# EAGLE design main (EAGLE 6.6.0)
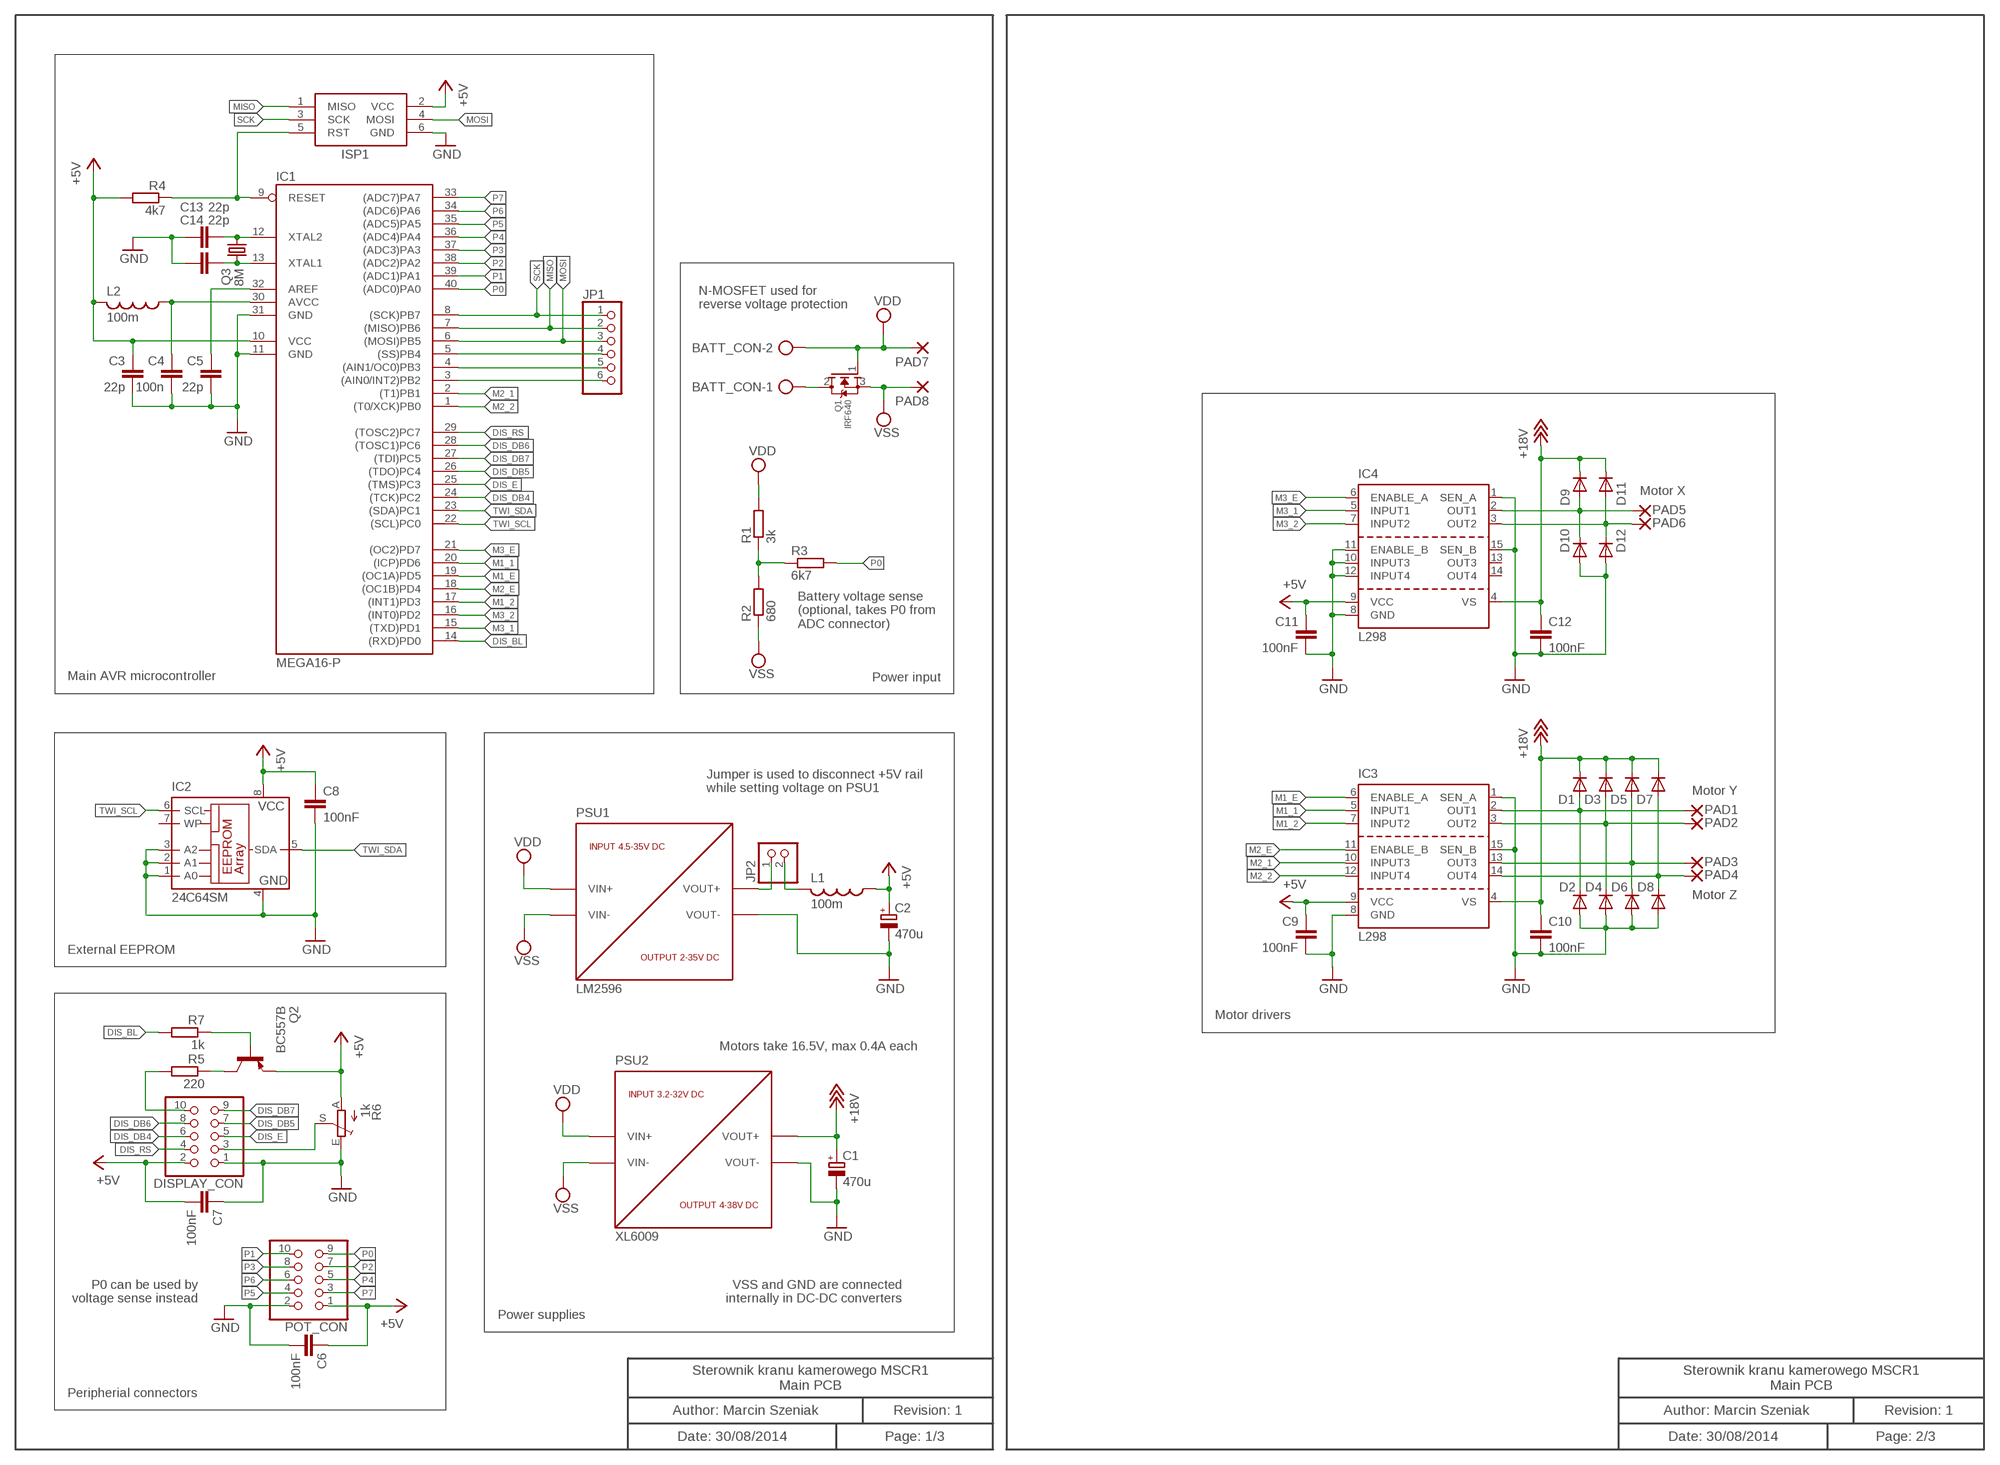
[diagram p0: schematic, sheet 1]

## Parts
BATT_CON  AK500/2-H  [AK500/2-H]
C1  470u  CPOL-EUE3.5-8  [E3,5-8]
C2  470u  CPOL-EUE5-8.5  [E5-8,5]
C3  22p  C-EU025-025X050  [C025-025X050]
C4  100n  C-EU025-025X050  [C025-025X050]
C5  22p  C-EU025-025X050  [C025-025X050]
C6  100nF  C-EU025-025X050  [C025-025X050]
C7  100nF  C-EU050-024X044  [C050-024X044]
C8  100nF  C-EU050-024X044  [C050-024X044]
C9  100nF  C-EU075-032X103  [C075-032X103]
C10  100nF  C-EU075-032X103  [C075-032X103]
C11  100nF  C-EU075-032X103  [C075-032X103]
C12  100nF  C-EU075-032X103  [C075-032X103]
C13  22p  C-EU025-025X050  [C025-025X050]
C14  22p  C-EU025-025X050  [C025-025X050]
D1  UF4003  [DO41-10]
D2  UF4003  [DO41-10]
D3  UF4003  [DO41-10]
D4  UF4003  [DO41-10]
D5  UF4003  [DO41-10]
D6  UF4003  [DO41-10]
D7  UF4003  [DO41-10]
D8  UF4003  [DO41-10]
D9  UF4003  [DO41-10]
D10  UF4003  [DO41-10]
D11  UF4003  [DO41-10]
D12  UF4003  [DO41-10]
DISPLAY_CON  PINHD-2X5  [2X05]
IC1  MEGA16-P  [DIL40]
IC2  24C64SM  [SO-08M]
IC3  L298  [MULTIWATT-15]
IC4  L298  [MULTIWATT-15]
ISP1  AVRISP-6  [AVRISP]
JP1  PINHD-1X6  [1X06]
JP2  PINHD-1X2  [1X02]
L1  100m  L-US0204/7  [0204/7]
L2  100m  L-US0204/7  [0204/7]
PAD1  2,54/1,1KLOCWIRE1  [KLOCWIRE1]
PAD2  2,54/1,1KLOCWIRE1  [KLOCWIRE1]
PAD3  2,54/1,1KLOCWIRE1  [KLOCWIRE1]
PAD4  2,54/1,1KLOCWIRE1  [KLOCWIRE1]
PAD5  2,54/1,1KLOCWIRE1  [KLOCWIRE1]
PAD6  2,54/1,1KLOCWIRE1  [KLOCWIRE1]
PAD7  2,54/1,1KLOCWIRE1  [KLOCWIRE1]
PAD8  2,54/1,1KLOCWIRE1  [KLOCWIRE1]
POT_CON  PINHD-2X5  [2X05]
PSU1  LM2596  DC-DC_CONV_DN  [DC-DC_CONV_MODULE]
PSU2  XL6009  DC-DC_CONV_UP  [DC-DC_CONV_MODULE]
Q1  IRF640  MOSFET-NGDS_TO220V  [TO220V]
Q2  BC557B  [TO92-EBC]
Q3  8M  CRYSTALTC26V  [TC26V]
R1  3k  R-EU_0204/7  [0204/7]
R2  680  R-EU_0204/7  [0204/7]
R3  6k7  R-EU_0204/5  [0204/5]
R4  4k7  R-EU_0204/5  [0204/5]
R5  220  R-EU_0204/7  [0204/7]
R6  1k  TRIM_EU-CA6V  [CA6V]
R7  1k  R-EU_0204/7  [0204/7]

## Nets
+5V: C2.+ C3.1 C6.1 C7.2 C8.1 C9.1 C11.1 DISPLAY_CON.2 IC1.10(VCC) IC2.8(VCC) IC3.9(VCC) IC4.9(VCC) ISP1.2(VCC) L1.1 L2.2 POT_CON.1 Q2.E R4.2 R6.A
+18V: C1.+ C10.1 C12.1 D1.C D3.C D5.C D7.C D9.C D11.C IC3.4(VS) IC4.4(VS) PSU2.OUT+(VOUT+)
DIS_BL: IC1.14((RXD)PD0) R7.2
DIS_DB4: DISPLAY_CON.6 IC1.24((TCK)PC2)
DIS_DB5: DISPLAY_CON.7 IC1.26((TDO)PC4)
DIS_DB6: DISPLAY_CON.8 IC1.28((TOSC1)PC6)
DIS_DB7: DISPLAY_CON.9 IC1.27((TDI)PC5)
DIS_E: DISPLAY_CON.5 IC1.25((TMS)PC3)
DIS_RS: DISPLAY_CON.4 IC1.29((TOSC2)PC7)
DIS_VO: DISPLAY_CON.3 R6.S
GND: C1.- C2.- C3.2 C4.2 C5.2 C6.2 C7.1 C8.2 C9.2 C10.2 C11.2 C12.2 C13.2 C14.2 D2.A D4.A D6.A D8.A D10.A D12.A DISPLAY_CON.1 IC1.11(GND) IC1.31(GND) IC2.1(A0) IC2.2(A1) IC2.3(A2) IC2.4(GND) IC3.1(SEN_A) IC3.8(GND) IC3.15(SEN_B) IC4.1(SEN_A) IC4.8(GND) IC4.10(INPUT3) IC4.11(ENABLE_B) IC4.12(INPUT4) IC4.15(SEN_B) ISP1.6(GND) POT_CON.2 PSU1.OUT-(VOUT-) PSU2.OUT-(VOUT-) R6.E
M1_1: IC1.20((ICP)PD6) IC3.5(INPUT1)
M1_2: IC1.17((INT1)PD3) IC3.7(INPUT2)
M1_E: IC1.19((OC1A)PD5) IC3.6(ENABLE_A)
M2_1: IC1.2((T1)PB1) IC3.10(INPUT3)
M2_2: IC1.1((T0/XCK)PB0) IC3.12(INPUT4)
M2_E: IC1.18((OC1B)PD4) IC3.11(ENABLE_B)
M3_1: IC1.15((TXD)PD1) IC4.5(INPUT1)
M3_2: IC1.16((INT0)PD2) IC4.7(INPUT2)
M3_E: IC1.21((OC2)PD7) IC4.6(ENABLE_A)
MISO: IC1.7((MISO)PB6) ISP1.1(MISO) JP1.2
MOSI: IC1.6((MOSI)PB5) ISP1.4(MOSI) JP1.3
N$1: JP2.1 PSU1.OUT+(VOUT+)
N$2: DISPLAY_CON.10 R5.2
N$3: IC1.5((SS)PB4) JP1.4
N$4: IC1.4((AIN1/OC0)PB3) JP1.5
N$5: IC1.3((AIN0/INT2)PB2) JP1.6
N$6: BATT_CON.1 Q1.2(D)
N$8: D1.A D2.C IC3.2(OUT1) PAD1.1(P)
N$9: D3.A D4.C IC3.3(OUT2) PAD2.1(P)
N$10: D5.A D6.C IC3.13(OUT3) PAD3.1(P)
N$11: D9.A D10.C IC4.2(OUT1) PAD5.1(P)
N$12: D7.A D8.C IC3.14(OUT4) PAD4.1(P)
N$13: D11.A D12.C IC4.3(OUT2) PAD6.1(P)
N$14: C13.1 IC1.12(XTAL2) Q3.2
N$15: Q2.C R5.1
N$16: C14.1 IC1.13(XTAL1) Q3.1
N$19: JP2.2 L1.2
N$20: Q2.B R7.1
N$25: C4.1 IC1.30(AVCC) L2.1
N$26: C5.1 IC1.32(AREF)
N$28: R1.1 R2.2 R3.1
N$30: IC1.9(RESET) ISP1.5(RST) R4.1
P0: IC1.40((ADC0)PA0) POT_CON.9 R3.2
P1: IC1.39((ADC1)PA1) POT_CON.10
P2: IC1.38((ADC2)PA2) POT_CON.7
P3: IC1.37((ADC3)PA3) POT_CON.8
P4: IC1.36((ADC4)PA4) POT_CON.5
P5: IC1.35((ADC5)PA5) POT_CON.4
P6: IC1.34((ADC6)PA6) POT_CON.6
P7: IC1.33((ADC7)PA7) POT_CON.3
SCK: IC1.8((SCK)PB7) ISP1.3(SCK) JP1.1
TWI_SCL: IC1.22((SCL)PC0) IC2.6(SCL)
TWI_SDA: IC1.23((SDA)PC1) IC2.5(SDA)
VDD: BATT_CON.2 PAD7.1(P) PSU1.IN+(VIN+) PSU2.IN+(VIN+) Q1.1(G) R1.2
VSS: PAD8.1(P) PSU1.IN-(VIN-) PSU2.IN-(VIN-) Q1.3(S) R2.1
Unconnected: IC2.7(WP) IC4.13(OUT3) IC4.14(OUT4)

## Notes on the sheet
- N-MOSFET used for
  reverse voltage protection
- Motor X
- Battery voltage sense
  (optional, takes P0 from
  ADC connector)
- Power input
- Main AVR microcontroller
- Jumper is used to disconnect +5V rail
  while setting voltage on PSU1
- Motor Y
- Motor Z
- External EEPROM
- Motor drivers
- Motors take 16.5V, max 0.4A each
- P0 can be used by
  voltage sense instead
- VSS and GND are connected
  internally in DC-DC converters
- Power supplies
- Sterownik kranu kamerowego MSCR1
  Main PCB
- Sterownik kranu kamerowego MSCR1
  Main PCB
- Peripherial connectors
- Author: Marcin Szeniak | Revision: 1 | Author: Marcin Szeniak | Revision: 1
- Date: 30/08/2014 | Page: 1/3 | Date: 30/08/2014 | Page: 2/3

## Library data of the parts
BATT_CON = con-ptr500:AK500/2-H: CONNECTOR Aug. 2004 / PTR Meßtechnik: Die Bezeichnung der Serie AK505 wurde geändert. Es handelt sich hierbei um AK500 in horizontaler Ausführung.; OC_FARNELL: unknown; OC_NEWARK: unknown
C1 C2 = rcl:CPOL-EU: POLARIZED CAPACITOR, European symbol
C3-C14 = rcl:C-EU: CAPACITOR, European symbol
D1-D12 = diode:UF4003: DIODE ultrafast recovery diode, 200 V rectifier
DISPLAY_CON POT_CON = pinhead:PINHD-2X5: PIN HEADER
IC1 = atmel:MEGA16-P: MICROCONTROLLER 16 Kbytes FLASH 1 kbytes SRAM 512 bytes EEPROM USART 8-channel 10 bit ADC Source: avr.lbr; MPN: ATMEGA16-16PU; OC_FARNELL: 9171142; OC_NEWARK: 01M6885
IC2 = microchip:24*: Serial EEPROM I2C; MF: RAMTRON INTERNATIONAL CORP; MPN: FM24C64-S; OC_FARNELL: 9882685; OC_NEWARK: 98H0189
IC3 IC4 = st-microelectronics:L298: DUAL FULL-BRIDGE DRIVER; MPN: L298N; OC_FARNELL: 1589425; OC_NEWARK: 32M1527
ISP1 = adafruit:AVRISP: AVR ISP HEADER Standard 6 pin header for AVR programming
JP1 = pinhead:PINHD-1X6: PIN HEADER
JP2 = pinhead:PINHD-1X2: PIN HEADER
L1 L2 = resistor:L-US: INDUCTOR, American symbol
PAD1-PAD8 = wirepad:2,54/1,1: THROUGH-HOLE PAD
PSU1 = temp_control:DC-DC_CONV_DN
PSU2 = temp_control:DC-DC_CONV_UP
Q1 = adafruit:MOSFET-N: N-Channel Mosfet 2N7002E - 60V 260mA SOT23 [Digikey: 2N7002ET1GOSTR-ND] - REEL BSH103 - 30V 850mA SOT23 [Digikey: 568-5013-1-ND]
Q2 = transistor-pnp:BC557*: PNP Transistror
Q3 = crystal:CRYSTAL: CRYSTAL; OC_FARNELL: unknown; OC_NEWARK: unknown
R1-R5 R7 = resistor:R-EU_: RESISTOR, European symbol
R6 = pot:TRIM_EU-: POTENTIOMETER

## Board
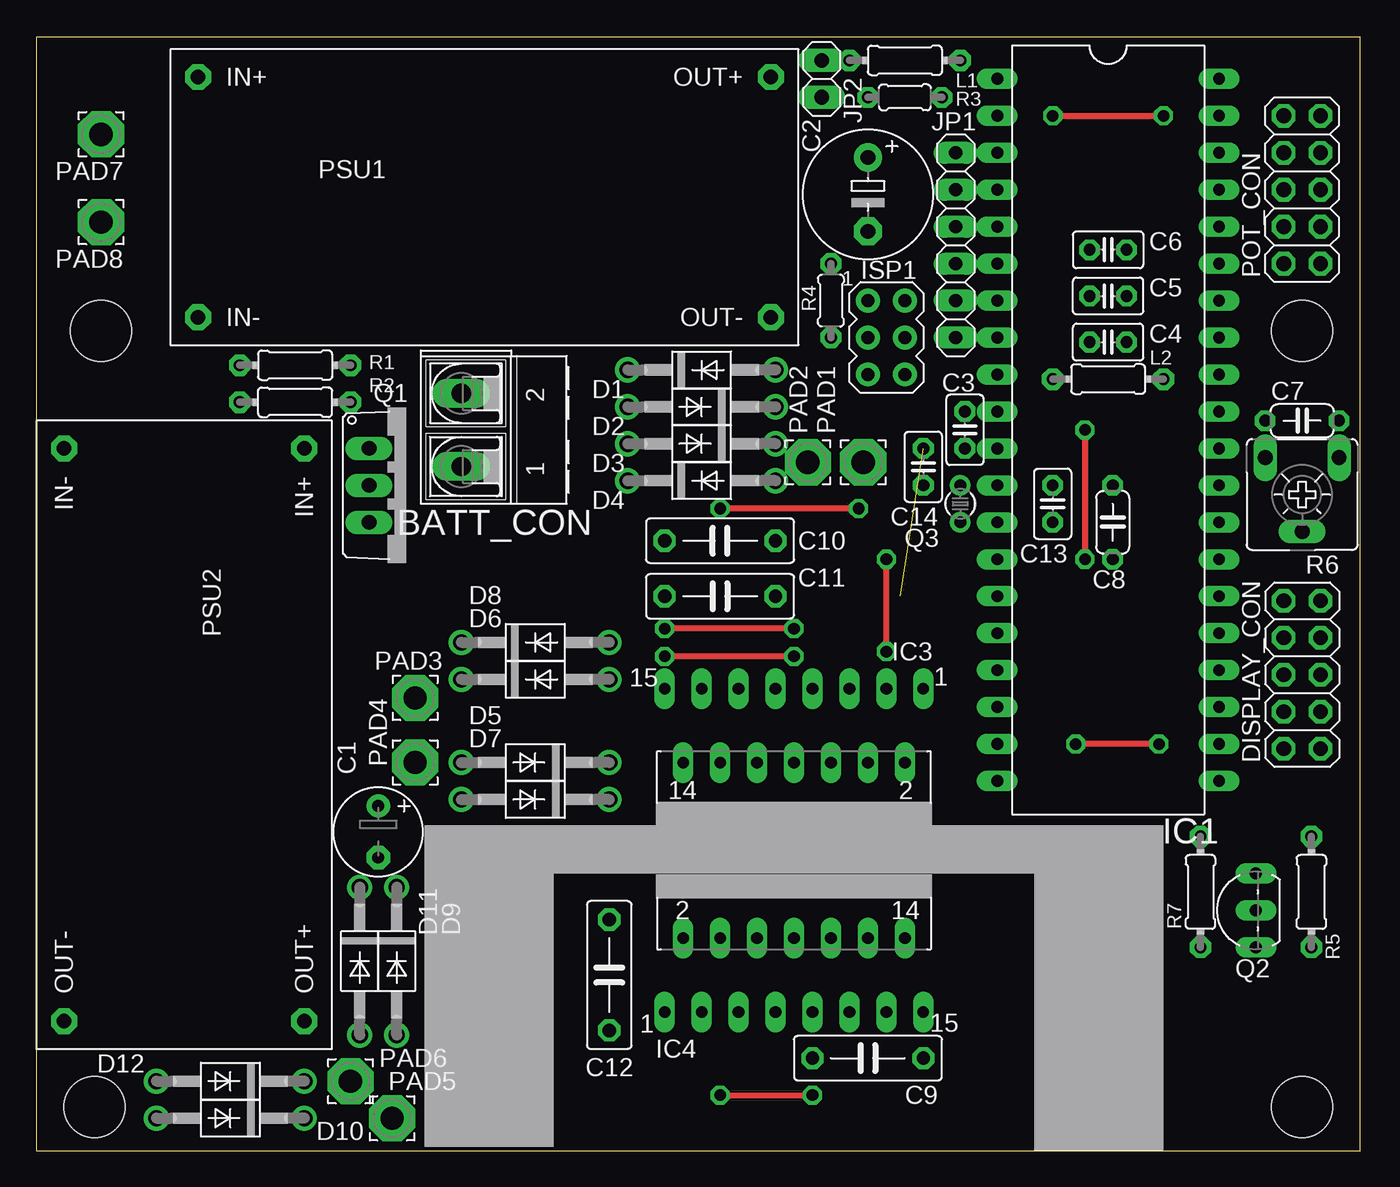
[diagram p1: board, top side]
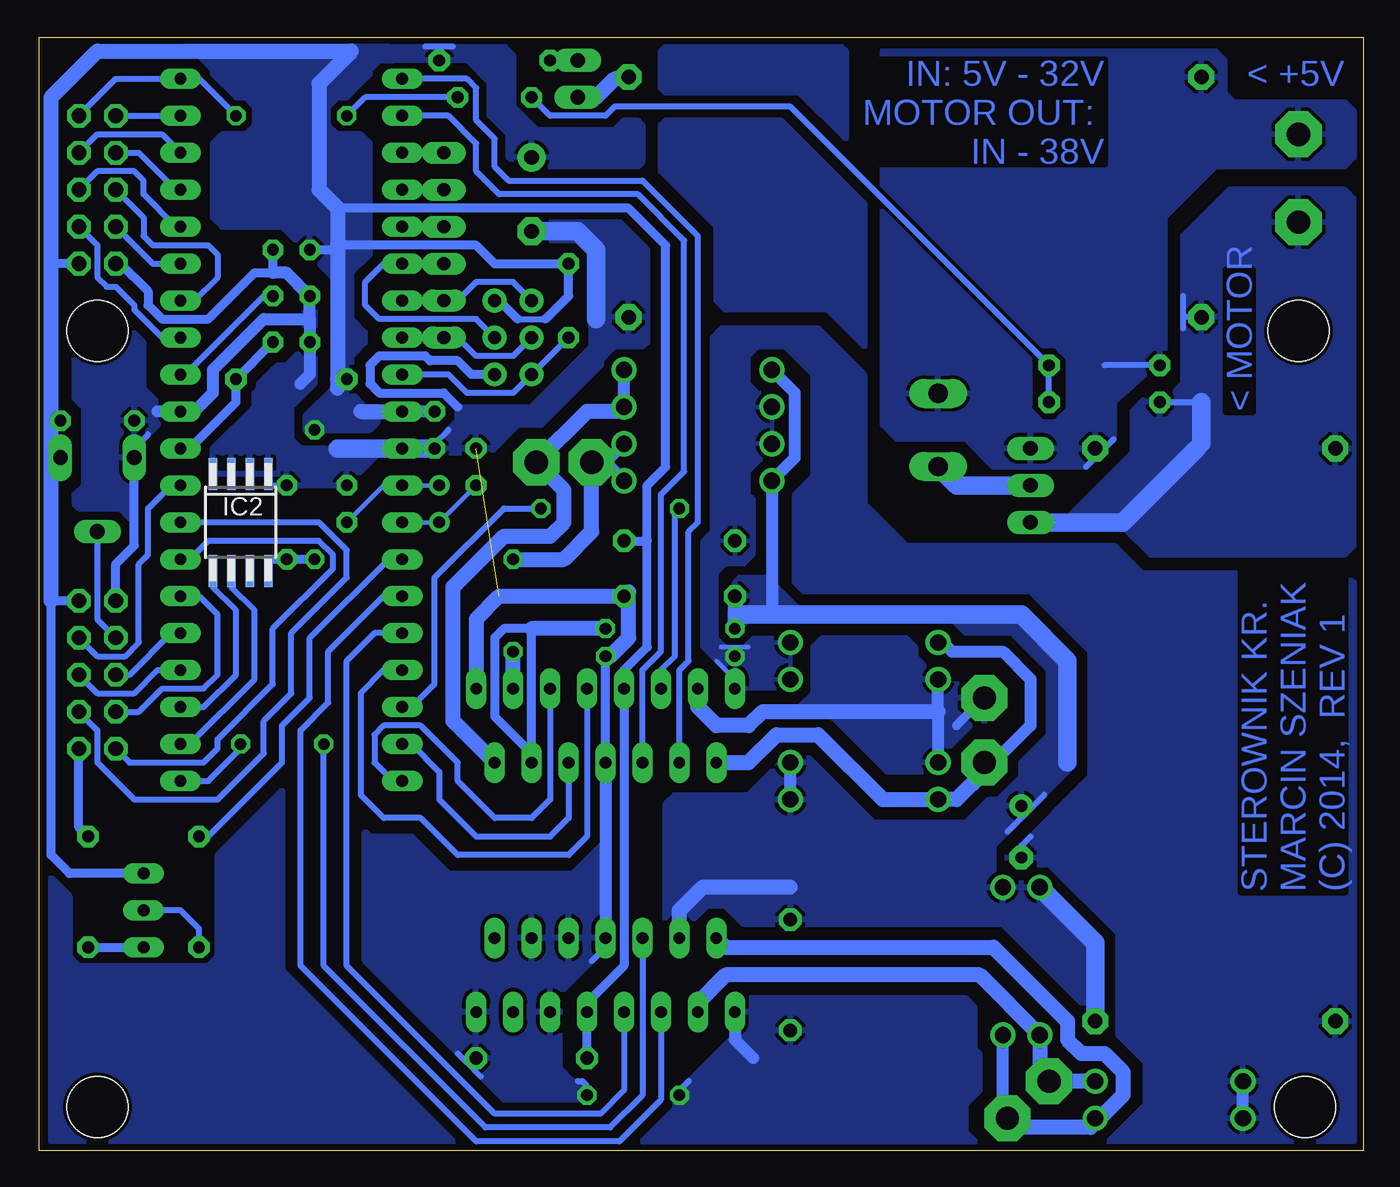
[diagram p2: board, bottom side, seen from below]

Size 91 x 76.51 mm. Coordinates in mm from the lower left corner, seen from the top.
Outline: 0,0 91,0 91,76.51 0,76.51 0,0
Copper layers (1*16): Top 0.035mm / dielectric 1.5mm / Bottom 0.035mm
Design rules "sparkfun_kloc *": minimum track width 10mil, minimum drill 20mil, track to track 10mil, track to pad 10mil, pad to pad 10mil, via to via 10mil, smd to smd 8mil, copper to edge 10mil, drill to drill 10mil, minimum pad ring 12mil, minimum via ring 10mil, stop-mask expansion 4mil, vias tented up to drill 25mil, thermal gap 10mil
Holes 4.19 mm at 4,3 87,3 87,56.34 4.45,56.34
bRestrict: area 20.6,50.5 to 22.5,54.9

### Footprints (pad centres in the part's own frame; a part is rotated, then mirrored left to right if it is on the bottom)
AK500/2-H = drill 1.321 long: 1 -2.515,0; 2 2.515,0
E3,5-8 = drill 0.813 pad 1.6: + -1.778,0 | drill 0.813 pad 1.6 octagon: - 1.778,0
E5-8,5 = drill 1.016 pad 1.93: + -2.54,0 | drill 1.016 pad 1.93 octagon: - 2.54,0
C025-025X050 = drill 0.813 octagon: 1 -1.27,0; 2 1.27,0
C050-024X044 = drill 0.813 octagon: 1 -2.54,0; 2 2.54,0
C075-032X103 = drill 0.914 octagon: 1 -3.81,0; 2 3.81,0
DO41-10 = drill 1.118: A 5.08,0; C -5.08,0
2X05 = drill 1.016 octagon: 1 -5.08,-1.27; 2 -5.08,1.27; 3 -2.54,-1.27; 4 -2.54,1.27; 5 0,-1.27; 6 0,1.27; 7 2.54,-1.27; 8 2.54,1.27; 9 5.08,-1.27; 10 5.08,1.27
DIL40 = drill 0.813 long: 1 -24.13,-7.62; 2 -21.59,-7.62; 3 -19.05,-7.62; 4 -16.51,-7.62; 5 -13.97,-7.62; 6 -11.43,-7.62; 7 -8.89,-7.62; 8 -6.35,-7.62; 9 -3.81,-7.62; 10 -1.27,-7.62; 11 1.27,-7.62; 12 3.81,-7.62; 13 6.35,-7.62; 14 8.89,-7.62; 15 11.43,-7.62; 16 13.97,-7.62; 17 16.51,-7.62; 18 19.05,-7.62; 19 21.59,-7.62; 20 24.13,-7.62; 21 24.13,7.62; 22 21.59,7.62; 23 19.05,7.62; 24 16.51,7.62; 25 13.97,7.62; 26 11.43,7.62; 27 8.89,7.62; 28 6.35,7.62; 29 3.81,7.62; 30 1.27,7.62; 31 -1.27,7.62; 32 -3.81,7.62; 33 -6.35,7.62; 34 -8.89,7.62; 35 -11.43,7.62; 36 -13.97,7.62; 37 -16.51,7.62; 38 -19.05,7.62; 39 -21.59,7.62; 40 -24.13,7.62
SO-08M = smd 0.6 x 2.2: 1 -1.905,-3.33; 2 -0.635,-3.33; 3 0.635,-3.33; 4 1.905,-3.33; 5 1.905,3.33; 6 0.635,3.33; 7 -0.635,3.33; 8 -1.905,3.33
MULTIWATT-15 = drill 0.8 pad 1.27 long: 1 -8.89,-7.62; 2 -7.62,-2.54; 3 -6.35,-7.62; 4 -5.08,-2.54; 5 -3.81,-7.62; 6 -2.54,-2.54; 7 -1.27,-7.62; 8 0,-2.54; 9 1.27,-7.62; 10 2.54,-2.54; 11 3.81,-7.62; 12 5.08,-2.54; 13 6.35,-7.62; 14 7.62,-2.54; 15 8.89,-7.62
AVRISP = drill 0.9 pad 1.626: 1 -1.27,2.54; 2 1.27,2.54; 3 -1.27,0; 4 1.27,0; 5 -1.27,-2.54; 6 1.27,-2.54
1X06 = drill 0.9 long: 1 -6.35,0; 2 -3.81,0; 3 -1.27,0; 4 1.27,0; 5 3.81,0; 6 6.35,0
1X02 = drill 1.016 long: 1 -1.27,0; 2 1.27,0
0204/7 = drill 0.813 pad 1.473 octagon: 1 -3.81,0; 2 3.81,0
KLOCWIRE1 = drill 1.6 pad 3.175 octagon: 1 0,0
DC-DC_CONV_MODULE = drill 1 pad 1.778 octagon: IN+ -19.685,8.255; IN- -19.685,-8.255; OUT+ 19.685,8.255; OUT- 19.685,-8.255
TO220V = drill 1.016 long: 1 -2.54,-2.54; 2 0,-2.54; 3 2.54,-2.54
TO92-EBC = drill 0.813 long: B 0,-1.27; C -2.54,-1.27; E 2.54,-1.27
TC26V = drill 0.813: 1 -1.27,0; 2 1.27,0
0204/5 = drill 0.813 octagon: 1 -2.54,0; 2 2.54,0
CA6V = drill 1.016 long: A -2.54,-2.54; E 2.54,-2.54; S 0,2.54

### Placement (x,y rotation side)
BATT_CON  29.21,49.53 90 top
C1  23.5,21.91 270 top
C2  57.15,65.72 270 top
C3  63.82,49.53 270 top
C4  73.66,55.56 180 top
C5  73.66,58.74 180 top
C6  73.66,61.91 0 top
C7  87,50.16 0 top
C8  73.98,43.18 90 top
C9  57.15,6.35 0 top
C10  46.99,38.1 0 top
C11  46.99,41.91 180 top
C12  39.37,12.06 270 top
C13  69.85,44.45 90 top
C14  60.96,46.99 90 top
D1  45.72,53.66 0 top
D2  45.72,51.12 180 top
D3  45.72,46.04 0 top
D4  45.72,48.58 180 top
D5  34.29,26.67 180 top
D6  34.29,32.38 0 top
D7  34.29,24.13 180 top
D8  34.29,34.92 0 top
D9  24.77,13.02 270 top
D10  13.34,2.22 180 top
D11  22.23,13.02 270 top
D12  13.34,4.76 180 top
DISPLAY_CON  87,32.7 270 top
IC1  73.66,49.53 270 top
IC2  77.15,43.18 180 bottom
IC3  52.07,24.13 180 top
IC4  52.07,17.14 0 top
ISP1  58.42,55.88 0 top
JP1  63.18,62.23 90 top
JP2  53.98,73.66 90 top
L1  59.69,74.93 180 top
L2  73.66,53.02 180 top
PAD1  56.83,47.31 0 top
PAD2  53.02,47.31 0 top
PAD3  26.04,31.11 0 top
PAD4  26.04,26.67 0 top
PAD5  24.45,2.22 0 top
PAD6  21.59,4.76 0 top
PAD7  4.45,69.85 180 top
PAD8  4.45,63.82 180 top
POT_CON  87,66.04 90 top
PSU1  30.8,65.53 0 top
PSU2  10.16,28.57 270 top
Q1  25.4,45.72 270 top
Q2  82.55,16.51 90 top
Q3  63.5,44.45 90 top
R1  17.78,53.98 180 top
R2  17.78,51.44 0 top
R3  59.69,72.39 0 top
R4  54.61,58.42 90 top
R5  87.63,17.78 90 top
R6  87,45.09 180 top
R7  80.01,17.78 90 top
U$1  [HEATSINK_GN2611]  52.07,19.05 180 top

### Tracks (layer width: path | path; a pad name or v marks a point on that pad's centre or on a via)
+5V  (via drill 0.8 pad 1.02)
  Top 0.406: v72.07,49.53 v72.07,40.64
  Bottom 0.406: 58.1,57.15 56.2,57.15 | 62.55,75.88 63.5,75.88 | 63.5,75.88 64.45,75.88 | 63.5,75.88 L1.1
  Bottom 0.61: POT_CON.1 90.17,60.96 | DISPLAY_CON.2 90.17,37.78 90.17,20.32 88.9,19.05 Q2.E | C9.1 IC4.9 53.34,10.16 50.8,12.7 IC3.9 50.8,33.02 49.21,34.61 49.21,41.91 | 49.21,41.91 49.21,45.72 47.94,46.99 47.94,62.23 50.48,64.77 70.48,64.77 | ISP1.2 59.37,58.42 58.1,57.15 | 56.2,57.15 54.61,58.74 R4.2 59.69,60.96 60.96,62.23 70.48,62.23 | v72.07,40.64 C8.1 75.25,40.64 IC2.8 | C7.2 90.17,50.16 | R6.A 90.17,47.62 | C6.1 70.48,61.91 | C11.1 49.21,41.91
  Bottom 0.813: L2.2 70.48,53.02 | C3.1 IC1.10
  Bottom 1.016: 90.17,37.78 90.17,47.62 90.17,50.16 90.17,60.96 90.17,72.39 87,75.56 69.53,75.56 71.75,73.34 71.75,66.04 70.48,64.77 70.48,62.23 70.48,61.91 70.48,53.02 70.48,52.39 | 68.9,50.8 IC1.10
  pour Bottom: 66.99,75.88 80.96,75.88 80.64,75.25 80.01,75.25 79.06,74.3 79.06,73.98 77.47,72.39 76.83,72.39 76.2,71.75 76.2,70.48 76.83,69.85 78.42,69.85 79.06,69.22 79.06,64.14 78.42,63.5 74.3,63.5 70.8,60.01 70.8,52.39 72.71,50.48 72.71,49.53 72.39,49.21 72.07,49.21 71.75,49.53 68.26,49.53 67.31,50.48 66.04,50.48 66.04,50.8 66.36,51.12 68.58,51.12 69.53,52.07 69.53,54.61 68.58,55.56 68.58,56.2 69.53,57.15 69.53,60.33 68.26,61.59 68.26,69.22 68.9,69.85 70.48,69.85 71.12,70.48 71.12,71.75 70.48,72.39 69.85,72.39 68.26,73.98 68.26,74.3 67.63,74.93 66.67,74.93 66.67,75.56
  pour Bottom: 67.94,75.88 59.05,75.88 58.42,75.25 58.42,71.75 56.83,70.17 51.44,70.17 50.8,70.8 49.85,70.8 49.53,70.48 49.53,67.94 49.85,67.63 58.1,67.63 58.74,68.26 58.74,69.85 60.01,71.12 60.01,73.34 61.59,74.93 68.58,74.93 67.94,75.56
+18V  (via drill 0.8 pad 1.02)
  Top 0.406: v52.07,35.88 v43.18,35.88
  Bottom 0.406: 24.45,21.91 21.91,24.45
  Bottom 0.61: IC3.4 57.15,27.3 | 57.15,27.3 57.15,35.88 59.05,35.88 59.69,35.24 59.69,29.84 57.15,27.3
  Bottom 0.813: D7.C D5.C | D1.C 39.05,52.07 39.05,47.62 D3.C 40.64,36.83
  Bottom 1.016: IC4.4 46.99,16.51 45.4,18.1 39.37,18.1 | C10.1 v43.18,35.88 | v52.07,35.88 57.15,35.88
  Bottom 1.27: 42.86,36.83 40.64,36.83 23.5,36.83 20.32,33.66 20.32,26.67 | D11.C 18.41,14.29 PSU2.OUT+
  pour Bottom: 19.37,10.16 24.77,15.56 42.55,15.56 43.81,16.83 45.09,16.83 46.04,15.88 47.94,15.88 47.94,23.81 47.31,24.45 42.23,24.45 39.69,26.99 38.1,26.99 33.66,22.54 27.3,22.54 25.72,24.13 25.08,24.13 23.5,25.72 23.5,26.67 21.59,28.57 21.59,33.02 24.13,35.56 27.3,35.56 28.89,37.15 23.5,37.15 20,33.66 20,26.35 25.4,20.95 25.4,18.41 22.23,18.41 18.1,14.29 18.1,10.16
  pour Bottom: 43.5,38.73 42.86,39.37 40.96,39.37 38.1,36.51 42.23,36.51 43.18,35.56 43.5,35.56
DIS_BL
  Bottom 0.406: IC1.14 66.99,40.64 72.39,35.24 72.39,31.11 74.3,29.21 74.3,26.67 79.38,21.59 R7.2
DIS_DB4
  Bottom 0.406: DISPLAY_CON.6 87,31.43 84.45,31.43 82.87,33.02 IC1.24
DIS_DB5
  Bottom 0.406: DISPLAY_CON.7 84.14,30.16 82.55,31.75 79.69,31.75 78.74,32.7 78.74,36.83 80.01,38.1 IC1.26
DIS_DB6
  Bottom 0.406: DISPLAY_CON.8 87,28.89 87,26.67 84.45,24.13 78.74,24.13 75.56,27.3 75.56,29.53 73.66,31.43 73.66,35.56 69.85,39.37 69.85,41.27 71.75,43.18 IC1.28
DIS_DB7
  Bottom 0.406: DISPLAY_CON.9 84.77,26.67 79.69,26.67 78.74,27.62 78.74,28.26 74.93,32.07 74.93,35.88 70.8,40.01 70.8,40.96 71.75,41.91 79.38,41.91 80.64,40.64 IC1.27
DIS_E
  Bottom 0.406: DISPLAY_CON.5 84.77,32.7 81.92,35.56 IC1.25
DIS_RS
  Bottom 0.406: DISPLAY_CON.4 87,33.97 85.09,33.97 84.14,34.92 84.14,40.32 83.5,40.96 83.5,44.13 81.92,45.72 IC1.29
DIS_VO
  Bottom 0.406: R6.S 87,36.51 DISPLAY_CON.3
GND  (via drill 0.8 pad 1.02)  (1 unrouted)
  Top 0.406: v46.99,3.81 v53.34,3.81 | v52.07,33.97 v43.18,33.97
  Bottom 0.305: 44.13,34.61 43.18,34.61 | 43.18,34.61 42.23,34.61 | 43.18,34.61 v43.18,33.97 | 44.45,33.66 42.86,32.07
  Bottom 0.406: 23.5,20.95 22.86,21.59 | 53.98,4.76 53.66,4.76 53.34,4.45 v53.34,3.81 | 46.35,4.76 46.99,4.13 v46.99,3.81 | 60.64,5.08 61.59,6.03 | 61.59,6.03 62.23,6.67 | C9.2 61.28,6.35 61.59,6.03 | 53.02,13.02 52.07,13.97 IC4.8 | 75.25,46.67 75.25,45.72 C8.2 | 62.87,49.53 63.82,48.58 C3.2 | 83.5,49.21 84.45,48.26 R6.E
  Bottom 0.61: DISPLAY_CON.1 85.72,40.32 84.45,41.59 84.45,46.35 | IC3.8 v52.07,33.97 | ISP1.6 61.28,53.34 62.23,54.29 64.14,54.29 64.45,54.61 67.63,54.61 68.26,53.98 68.26,52.7 67.63,52.07 63.18,52.07 62.23,51.12 | POT_CON.2 85.41,60.96 83.5,59.05 83.5,58.1 82.55,57.15 79.38,57.15 76.2,60.33 74.93,60.33 C6.2
  Bottom 0.813: 72.39,57.15 C4.2 72.39,53.34 73.03,52.7 | 72.39,57.15 75.56,57.15 79.06,53.66 79.06,52.07 80.33,50.8 IC1.31 82.87,50.8 | IC3.8 IC4.8 | D10.A D12.A | 50.48,38.42 C10.2 | 72.39,57.15 C5.2 73.98,60.33 74.93,60.33 | IC4.1 43.18,7.62 41.91,6.35
  Bottom 1.016: IC3.1 60.96,36.51 59.37,38.1 C10.2 | v52.07,33.97 51.75,33.97 50.48,35.24 50.48,38.42
  Bottom 1.27: 70.48,48.26 IC1.11 C3.2 | 52.7,57.15 52.7,61.91 53.98,63.18 C2.-
  pour Bottom: 0.64,0.64 17.46,0.64 14.92,3.17 14.92,6.03 16.83,7.94 16.83,14.92 21.59,19.68 24.45,19.68 24.45,20.64 23.81,20.64 18.73,25.72 18.73,34.29 22.86,38.42 38.42,38.42 39.05,39.05 39.05,45.09 37.78,46.35 37.78,53.34 39.69,55.24 42.86,55.24 44.13,56.52 37.47,56.52 34.29,53.34 34.29,44.45 31.43,41.59 17.14,41.59 15.24,39.69 1.27,39.69 0.64,39.05
  pour Bottom: 53.34,3.49 59.05,3.49 68.58,13.02 68.58,21.91 68.26,21.59 65.41,21.59 62.87,19.05 54.29,19.05 52.07,21.27 52.07,13.97 55.24,10.79 55.24,5.71 54.29,4.76 53.98,4.76 53.34,4.13
  pour Bottom: 67.63,47.94 69.85,45.72 79.06,45.72 79.06,48.26 76.2,51.12 76.2,52.07 75.88,52.39 75.88,52.7 74.61,53.98 73.98,53.98 72.71,55.24 72.71,58.74 72.07,58.74 72.07,52.7 73.66,51.12 73.66,48.9 73.03,48.26 70.8,48.26 70.48,48.58 63.82,48.58 62.23,50.16 62.23,51.12 57.15,51.12 53.02,55.24 53.02,61.59 53.98,62.55 57.47,62.55 57.47,63.82 51.12,63.82 49.21,61.91 49.21,55.56 49.53,55.24 51.44,55.24 52.39,54.29 52.39,53.98 56.52,49.85 58.1,49.85 60.01,47.94
  pour Bottom: 49.53,0.64 26.67,0.64 27.3,1.27 27.3,3.17 26.35,4.13 26.35,6.67 26.67,6.99 26.67,9.84 27.3,10.48 43.18,10.48 43.18,7.94 47.31,3.81 47.31,2.86
  pour Bottom: 41.59,56.52 44.13,56.52 44.77,55.88 44.77,42.55 45.4,41.91 45.4,34.61 43.5,32.7 43.5,32.07 43.18,31.75 39.37,31.75 39.37,35.24 41.91,35.24 42.55,34.61 43.81,34.61 44.45,35.24 44.45,39.69 43.81,40.32 42.55,40.32 41.91,40.96 41.91,44.77 42.23,45.09 42.23,46.67 40.64,48.26 40.64,51.44 41.27,52.07 41.59,52.07 42.23,52.7 42.23,54.61 41.59,55.24
  pour Bottom: 82.23,51.12 82.55,51.12 83.82,52.39 83.82,55.56 85.41,57.15 87,57.15 88.58,55.56 88.58,51.75 87.95,51.12 87.95,45.72 88.58,45.09 88.58,44.45 88.27,44.13 85.41,44.13 84.45,43.18 84.45,46.04 83.82,46.67 83.82,48.9 82.23,50.48
M1_1
  Bottom 0.406: IC3.5 55.88,24.13 57.15,22.86 59.69,22.86 62.23,25.4 62.23,26.67 64.77,29.21 67.31,29.21 67.94,28.57 67.94,26.67 66.67,25.4 IC1.20
M1_2
  Bottom 0.406: IC3.7 53.34,21.59 54.61,20.32 62.23,20.32 64.77,22.86 67.31,22.86 68.9,24.45 68.9,31.43 67.31,33.02 IC1.17
M1_E
  Bottom 0.406: IC3.6 54.61,22.86 55.88,21.59 60.96,21.59 63.5,24.13 63.5,26.04 65.41,27.94 IC1.19
M2_1
  Bottom 0.406: IC3.10 49.53,33.02 48.26,34.29 48.26,45.09 46.67,46.67 46.67,62.55 49.85,65.72 59.37,65.72 60.96,67.31 60.96,69.22 62.87,71.12 IC1.2
M2_2
  Bottom 0.406: IC3.12 46.99,33.02 46.35,33.66 46.35,42.55 45.72,43.18 45.72,62.87 49.53,66.67 58.74,66.67 59.69,67.63 59.69,69.53 60.96,70.8 60.96,73.03 61.59,73.66 IC1.1
M2_E  (via drill 0.8 pad 1.02)
  Top 0.406: v56.52,44.13 v46.99,44.13
  Bottom 0.406: IC3.11 48.26,33.02 47.31,33.97 47.31,43.81 v46.99,44.13 | IC1.18 65.41,30.48 63.82,32.07 63.82,39.37 59.05,44.13 v56.52,44.13
M3_1
  Bottom 0.406: IC4.5 48.26,3.49 51.12,0.64 60.96,0.64 73.03,12.7 73.03,28.89 71.12,30.8 71.12,34.29 67.31,38.1 IC1.15
M3_2
  Bottom 0.406: IC4.7 50.8,4.13 52.39,2.54 59.69,2.54 69.85,12.7 69.85,33.66 67.94,35.56 IC1.16
M3_E  (via drill 0.8 pad 1.02)
  Top 0.406: v77.15,27.94 v71.44,27.94
  Bottom 0.406: IC1.21 79.38,25.4 77.15,27.62 v77.15,27.94 | IC4.6 49.53,3.81 51.75,1.59 60.33,1.59 71.44,12.7 v71.44,27.94
MISO
  Bottom 0.406: ISP1.1 58.42,59.69 60.96,59.69 62.23,58.42 JP1.2 IC1.7
MOSI
  Bottom 0.406: ISP1.4 60.96,57.15 67.63,57.15 68.58,58.1 68.58,59.69 67.31,60.96 IC1.6 JP1.3
N$1
  Bottom 1.016: PSU1.OUT+ 50.61,73.66 51.44,73.66 52.7,72.39 JP2.1
N$2
  Bottom 0.61: R5.2 88.27,22.23 DISPLAY_CON.10
N$3
  Bottom 0.406: JP1.4 IC1.5
N$4
  Bottom 0.406: JP1.5 IC1.4
N$5
  Bottom 0.406: JP1.6 IC1.3
N$6
  Bottom 1.27: Q1.2 27.91,45.72 BATT_CON.1
N$7
  pour Bottom: 62.55,0.64 90.17,0.64 90.17,18.73 88.9,17.46 88.9,13.34 88.27,12.7 79.38,12.7 78.74,13.34 78.74,20.32 74.3,24.77 74.3,12.38
N$8
  Bottom 0.813: D2.C D1.A
  Bottom 1.016: IC3.2 62.55,29.53 62.55,38.73 59.05,42.23 55.88,42.23 54.93,43.18 54.93,45.4 PAD1.1 53.34,50.8 51.12,50.8 D2.C
N$9  (via drill 0.8 pad 1.02)
  Top 0.406: v58.42,34.29 v58.42,40.64
  Bottom 0.813: D4.C 52.07,47.31 | 52.07,47.31 PAD2.1 | D3.A 52.07,47.31
  Bottom 1.016: IC3.3 v58.42,34.29 | v58.42,40.64 54.93,40.64 53.02,42.55 PAD2.1
N$10
  Bottom 0.61: PAD3.1 27.94,29.21
  Bottom 0.813: IC3.13 45.72,30.48 | D6.C 29.21,30.16 D5.A
  Bottom 1.016: 45.72,30.48 44.45,29.21 42.23,29.21 41.27,30.16 29.21,30.16
  pour Bottom: 29.21,26.04 32.7,26.04 36.51,29.84 39.37,29.84 39.37,30.48 38.73,30.48 37.78,31.43 37.78,34.61 37.15,35.24 31.43,35.24 30.8,34.61 30.8,33.97 28.89,32.07 25.4,32.07 25.4,29.84 25.72,29.53 26.67,29.53 28.57,27.62 28.57,26.67
N$11
  Bottom 0.813: D9.A 24.77,2.54 PAD5.1
  Bottom 1.016: IC4.2 43.81,13.97 25.4,13.97 20.32,8.89 20.32,7.62 19.37,6.67 17.78,6.67 16.51,5.4 16.51,3.81 18.1,2.22 | 18.1,2.22 D10.C | 18.1,2.22 18.73,1.59 23.81,1.59 PAD5.1
N$12
  Bottom 0.813: D7.A 28.89,24.13 | PAD4.1 25.4,26.67 22.86,29.21 22.86,32.38 24.77,34.29 28.26,34.29 28.89,34.92 D8.C
  Bottom 1.016: IC3.14 42.23,26.67 40.32,28.57 37.47,28.57 33.02,24.13 D7.A 27.94,24.13 26.04,26.04 PAD4.1
N$13
  Bottom 0.813: IC4.3 45.72,10.16
  Bottom 1.016: 45.72,10.16 43.81,12.06 26.35,12.06 D11.A 22.23,5.4 PAD6.1 D12.C
N$14
  Bottom 0.305: C13.1 67.31,45.72 IC1.12 Q3.2
N$15
  Bottom 0.61: R5.1 Q2.C
N$16
  Bottom 0.305: IC1.13 Q3.1 C14.1
N$17
  pour Bottom: 34.29,55.24 36.83,57.78 43.81,57.78 44.45,58.42 44.45,63.5 48.26,67.31 48.26,70.48 47.94,70.8 40.01,70.8 34.29,65.09
N$18
  pour Bottom: 35.56,69.53 38.73,72.71 47.94,72.71 48.26,73.03 48.26,75.56 47.94,75.88 35.88,75.88 35.56,75.56
N$19
  Bottom 1.016: JP2.2 L1.2
N$20
  Bottom 0.406: R7.1 80.01,15.24 81.28,16.51 Q2.B
N$25
  Bottom 0.61: IC1.30 80.64,48.26 77.47,51.44 L2.1 C4.1
N$26
  Bottom 0.406: IC1.32 80.96,53.34 75.56,58.74 C5.1
N$28
  Bottom 0.406: R2.2 R1.1 39.37,71.75 51.44,71.75 52.07,71.12 55.88,71.12 R3.1
N$30
  Bottom 0.406: IC1.9 62.87,53.34 61.59,52.07 58.42,52.07 ISP1.5 R4.1
P0  (via drill 0.8 pad 1.02)
  Top 0.406: v69.85,71.12 v77.47,71.12
  Bottom 0.406: POT_CON.9 85.72,73.66 IC1.40 80.01,73.66 v77.47,71.12 | R3.2 68.58,72.39 v69.85,71.12
P1
  Bottom 0.406: POT_CON.10 IC1.39
P2
  Bottom 0.406: POT_CON.7 87,69.85 82.55,69.85 IC1.38
P3
  Bottom 0.406: POT_CON.8 84.14,68.58 81.6,66.04 IC1.37
P4
  Bottom 0.406: IC1.36 81.6,63.5 83.82,65.72 83.82,66.67 84.45,67.31 87,67.31 POT_CON.5
P5
  Bottom 0.406: IC1.35 83.19,60.96 POT_CON.4
P6
  Bottom 0.406: POT_CON.6 83.82,64.14 83.82,62.87 83.19,62.23 79.38,62.23 78.74,61.59 78.74,60.01 80.33,58.42 IC1.34
P7
  Bottom 0.406: IC1.33 82.55,55.88 84.45,57.78 84.45,58.1 85.72,59.37 86.36,59.37 87,60.01 87,62.23 POT_CON.3
SCK
  Bottom 0.406: IC1.8 JP1.1 62.23,55.88 60.96,54.61 58.42,54.61 ISP1.3
TWI_SCL
  Bottom 0.406: IC1.22 80.64,27.94 76.2,32.38 76.2,37.15 77.79,38.73 IC2.6
TWI_SDA
  Bottom 0.406: IC1.23 79.69,30.48 77.47,32.7 77.47,37.15 79.06,38.73 IC2.5
VDD
  Bottom 0.406: R1.2 17.78,53.98 | 19.05,46.99 18.41,47.62 PSU2.IN+ 17.78,48.26 17.14,48.9
  pour Bottom: 19.05,46.99 25.4,46.99 27.3,48.9 32.07,48.9 33.02,49.85 33.02,75.56 10.16,75.56 9.53,74.93 9.53,72.71 8.89,72.07 1.27,72.07 0.64,71.44 0.64,68.26 1.27,67.63 10.16,67.63 13.65,64.14 13.65,53.98 14.29,53.98 17.14,51.44 17.14,48.9
VSS
  Bottom 0.406: R2.1 11.11,51.44 | PSU1.IN- 12.38,57.28 | 12.38,57.28 12.38,56.52 | 12.38,58.74 12.38,57.28
  Bottom 1.016: 11.43,48.26 11.11,48.58
  Bottom 1.27: Q1.3 16.51,43.18 11.43,48.26 | 11.11,48.58 11.11,51.44
  pour Bottom: 14.61,40.96 1.27,40.96 0.64,41.59 0.64,65.41 1.27,66.04 9.21,66.04 12.38,62.87 12.38,52.7 13.34,51.75 14.92,51.75 15.88,50.8 15.88,47.94 20.95,42.86 16.51,42.86

### Text on the board
Bottom: < +5V | IN: 5V - 32V / MOTOR OUT: / IN - 38V | < MOTOR | STEROWNIK KR. / MARCIN SZENIAK / (C) 2014, REV 1
tSilk: +5V > | < MOTOR | SARZYŃSCY / FOTO STUDIO | IN: 5V - 32V / MOTOR OUT: / IN - 38V